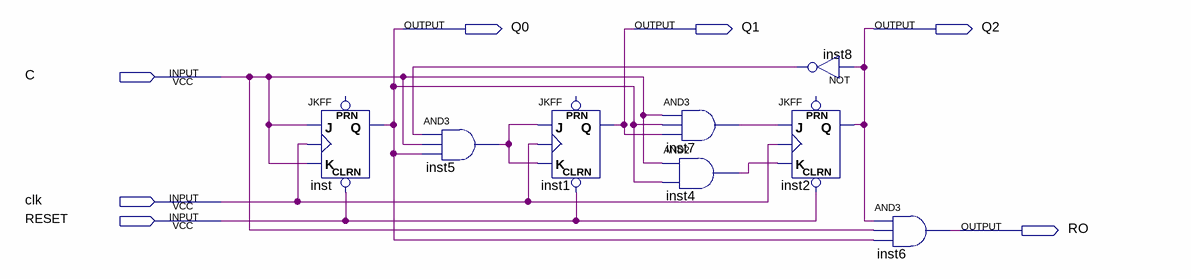
[diagram p0: schematic sheet]
// Quartus schematic mod6_counter.bdf as structural Verilog: 8 symbols, 7 pins
module mod6_counter (
  input  C,
  input  clk,
  input  RESET,
  output Q0,
  output Q1,
  output Q2,
  output RO
);

  wire inst4_out, inst5_out, inst7_out, inst8_out;

  JKFF inst (.CLRN(RESET), .K(C), .J(C), .CLK(clk), .Q(Q0));  // open: PRN
  and inst5 (inst5_out, inst8_out, C, Q0);
  JKFF inst1 (.CLRN(RESET), .K(inst5_out), .J(inst5_out), .CLK(clk), .Q(Q1));  // open: PRN
  and inst7 (inst7_out, C, Q0, Q1);
  and inst4 (inst4_out, C, Q0);
  not inst8 (inst8_out, Q2);
  JKFF inst2 (.CLRN(RESET), .K(inst4_out), .J(inst7_out), .CLK(clk), .Q(Q2));  // open: PRN
  and inst6 (RO, Q2, C, Q0);
endmodule
